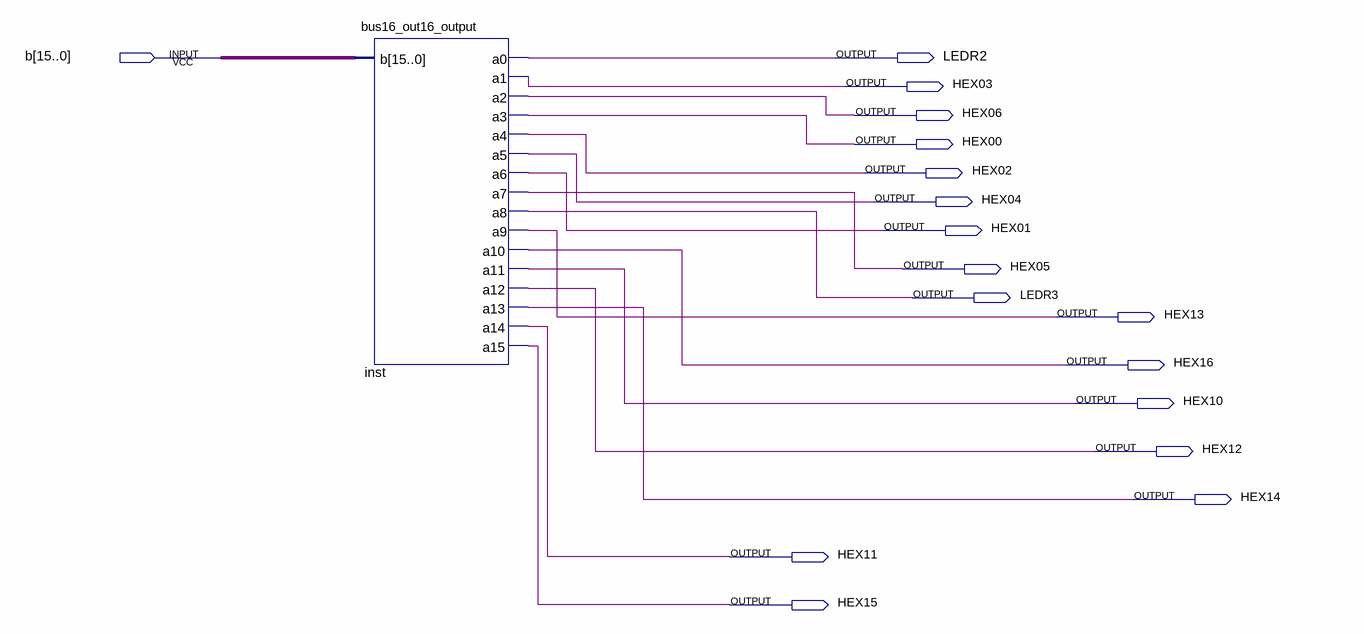
[diagram p0: schematic sheet]
// Quartus schematic bus16_out16_output.bdf as structural Verilog: 1 symbols, 17 pins
module bus16_out16_output (
  input  [15:0] b,
  output LEDR2,
  output HEX03,
  output HEX06,
  output HEX00,
  output HEX02,
  output HEX04,
  output HEX01,
  output HEX05,
  output LEDR3,
  output HEX13,
  output HEX16,
  output HEX10,
  output HEX12,
  output HEX14,
  output HEX11,
  output HEX15
);

  bus16_out16_output inst (
    .b(b), .a0(LEDR2), .a1(HEX03), .a2(HEX06), .a3(HEX00), .a4(HEX02), .a5(HEX04), .a6(HEX01), .a7(HEX05),
    .a8(LEDR3), .a9(HEX13), .a10(HEX16), .a11(HEX10), .a12(HEX12), .a13(HEX14), .a14(HEX11), .a15(HEX15));
endmodule
